# EAGLE design Branly_Pi_v2 (EAGLE 6.5.0)
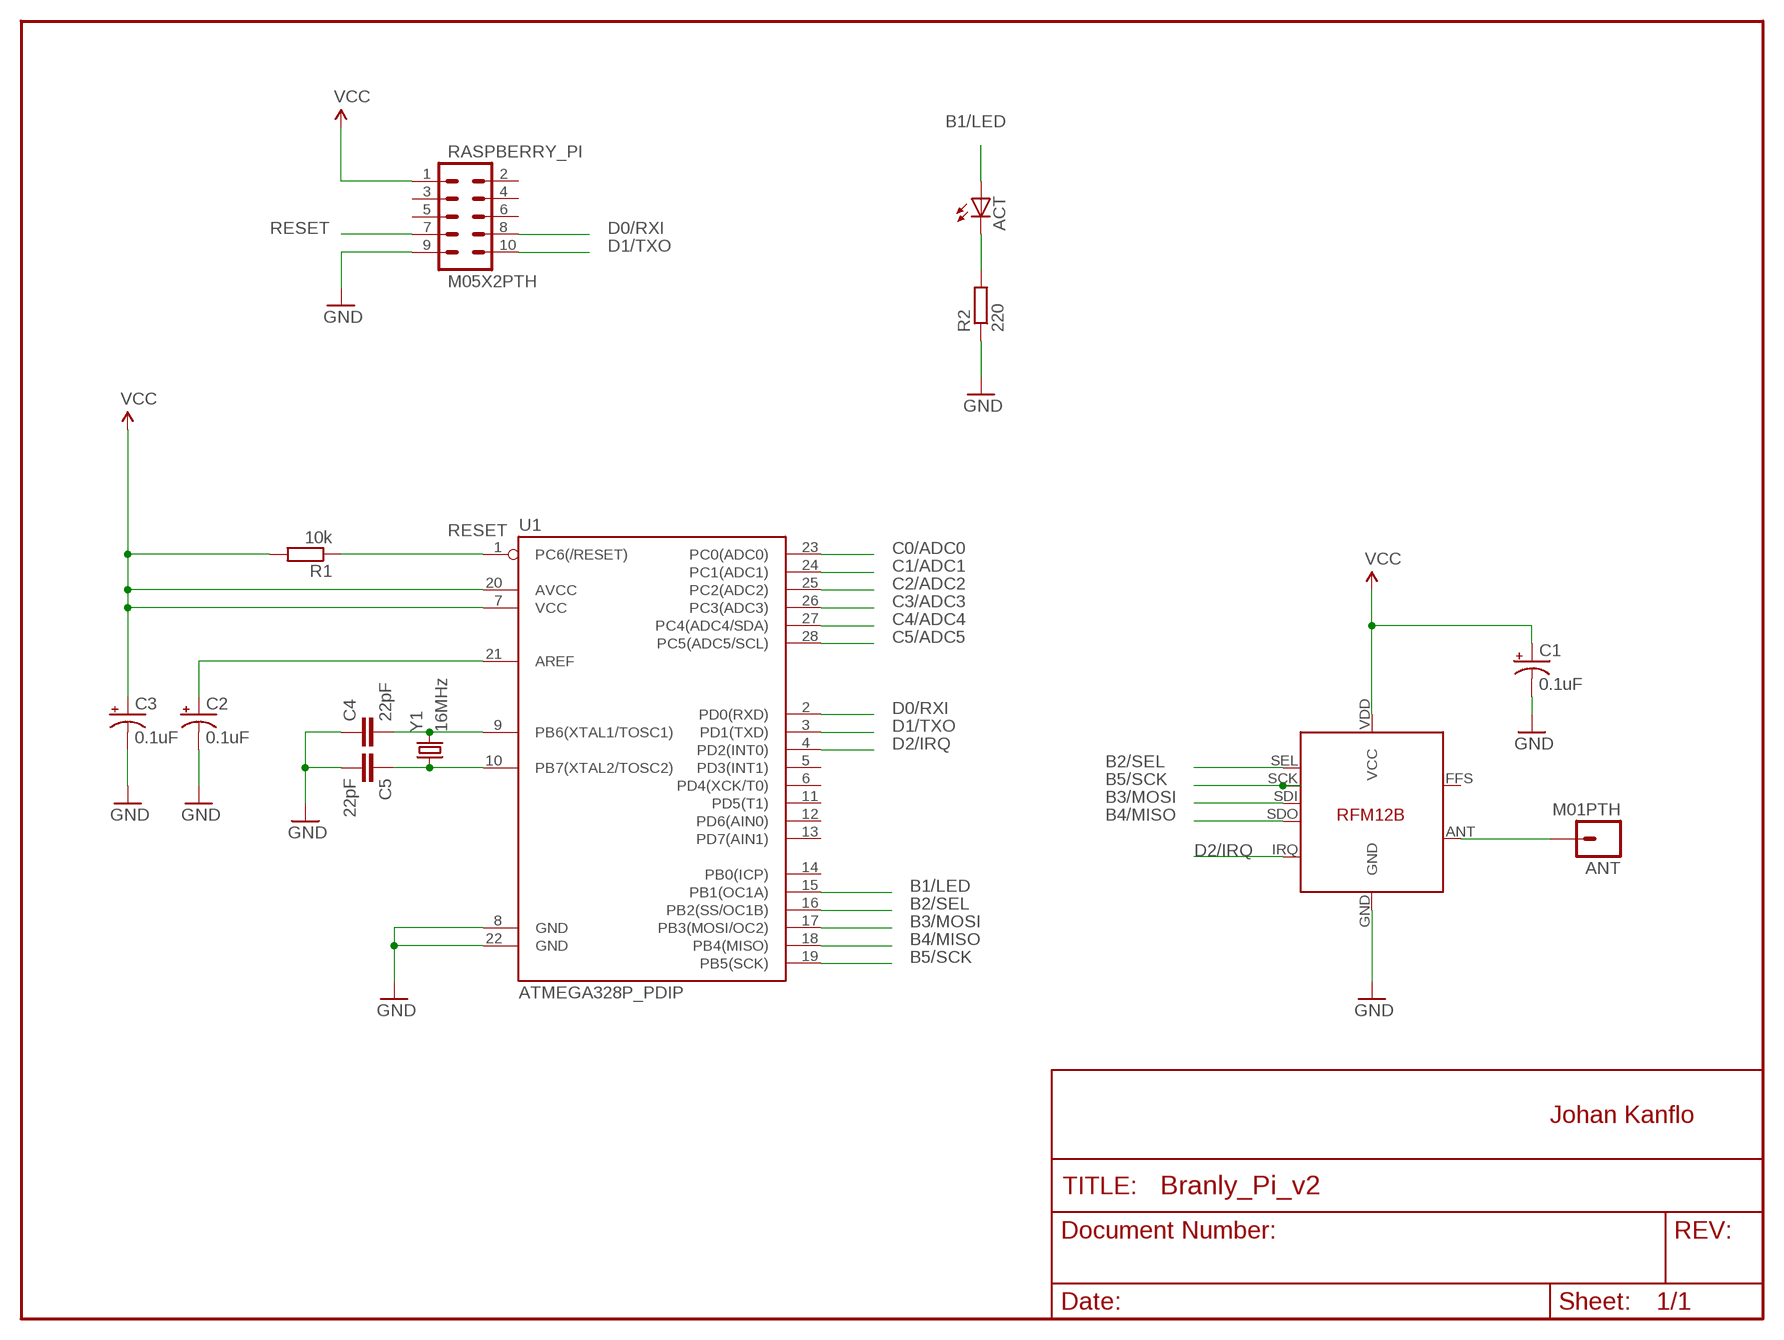
[diagram p0: schematic, sheet 1]

## Parts
ACT  LED5MM  [LED5MM]
ANT  M01PTH  [1X01]
C1  0.1uF  CAP_POLPTH2  [CPOL-RADIAL-10UF-25V]
C2  0.1uF  CAP_POLPTH2  [CPOL-RADIAL-10UF-25V]
C3  0.1uF  CAP_POLPTH2  [CPOL-RADIAL-10UF-25V]
C4  22pF  CAPPTH2  [CAP-PTH-SMALL2]
C5  22pF  CAPPTH2  [CAP-PTH-SMALL2]
R1  10k  R-EU_0207/7  [0207/7]
R2  220  R-EU_0207/7  [0207/7]
RASPBERRY_PI  M05X2PTH  [AVR_ICSP]
U1  ATMEGA328P_PDIP  [DIL28-3]
U2  RFM12B  [RFM12B]
Y1  16MHz  CRYSTALHC49US  [HC49US]

## Nets
ACT: ACT.K(C) R2.2
B1/LED: ACT.A U1.15(PB1(OC1A))
B2/SEL: U1.16(PB2(SS/OC1B)) U2.SEL
B3/MOSI: U1.17(PB3(MOSI/OC2)) U2.SDI
B4/MISO: U1.18(PB4(MISO)) U2.SDO
B5/SCK: U1.19(PB5(SCK)) U2.SCK
C0/ADC0: U1.23(PC0(ADC0))
C1/ADC1: U1.24(PC1(ADC1))
C2/ADC2: U1.25(PC2(ADC2))
C3/ADC3: U1.26(PC3(ADC3))
C4/ADC4: U1.27(PC4(ADC4/SDA))
C5/ADC5: U1.28(PC5(ADC5/SCL))
D0/RXI: RASPBERRY_PI.8 U1.2(PD0(RXD))
D1/TXO: RASPBERRY_PI.10 U1.3(PD1(TXD))
D2/IRQ: U1.4(PD2(INT0)) U2.IRQ
GND: C1.2(-) C2.2(-) C3.2(-) C4.1 C5.2 R2.1 RASPBERRY_PI.9 U1.8(GND) U1.22(GND) U2.GND
N$1: C4.2 U1.9(PB6(XTAL1/TOSC1)) Y1.2
N$2: C2.1(+) U1.21(AREF)
N$5: C5.1 U1.10(PB7(XTAL2/TOSC2)) Y1.1
N$6: ANT.1 U2.ANT
RESET: R1.1 RASPBERRY_PI.7 U1.1(PC6(/RESET))
VCC: C1.1(+) C3.1(+) R1.2 RASPBERRY_PI.1 U1.7(VCC) U1.20(AVCC) U2.VDD(VCC)
Unconnected: RASPBERRY_PI.2 RASPBERRY_PI.3 RASPBERRY_PI.4 RASPBERRY_PI.5 RASPBERRY_PI.6 U1.5(PD3(INT1)) U1.6(PD4(XCK/T0)) U1.11(PD5(T1)) U1.12(PD6(AIN0)) U1.13(PD7(AIN1)) U1.14(PB0(ICP)) U2.FFS

## Notes on the sheet
- Johan Kanflo

## Library data of the parts
ACT = SparkFun-LED:LED: LEDs Standard schematic elements and footprints for 5mm, 3mm, 1206, and 0603 sized LEDs. 5mm - Spark Fun Electronics SKU : COM-00529 (and others)
ANT = SparkFun-Connectors:M01: Header 1 Standard 1-pin 0.1" header. Use with straight break away headers (SKU : PRT-00116), right angle break away headers (PRT-00553), swiss pins (PRT-00743), machine pins (PRT-00117), and female headers (PRT-00115).
C1-C3 = SparkFun-Passives:CAP_POL: Capacitor Polarized These are standard SMD and PTH capacitors. Normally 10uF, 47uF, and 100uF in electrolytic and tantalum varieties. Always verify the external diameter of the through hole cap, it varies with capacity, voltage, and manufacturer. The EIA devices should be standard.
C4 C5 = SparkFun-Capacitors:CAP: Capacitor Standard 0603 ceramic capacitor, and 0.1" leaded capacitor.
R1 R2 = resistor:R-EU_: RESISTOR, European symbol
RASPBERRY_PI = SparkFun-Connectors:M05X2: Header 5x2 Standard 10-pin dual row 0.1" header. Commonly used with AVR-ISP. Use with Spark Fun Electronics SKU: PRT-00778
U1 = SparkFun-DigitalIC:ATMEGA328P_PDIP: uC used in the Arduino 32kb flash, 1k EEPROM, 2k SRAM This is the through-hole version of this chip.
U2 = JeeParts:RFM12B
Y1 = SparkFun-FreqCtrl:CRYSTAL: Various standard crystals. Proven footprints. Spark Fun Electronics SKU : COM-00534

## Board
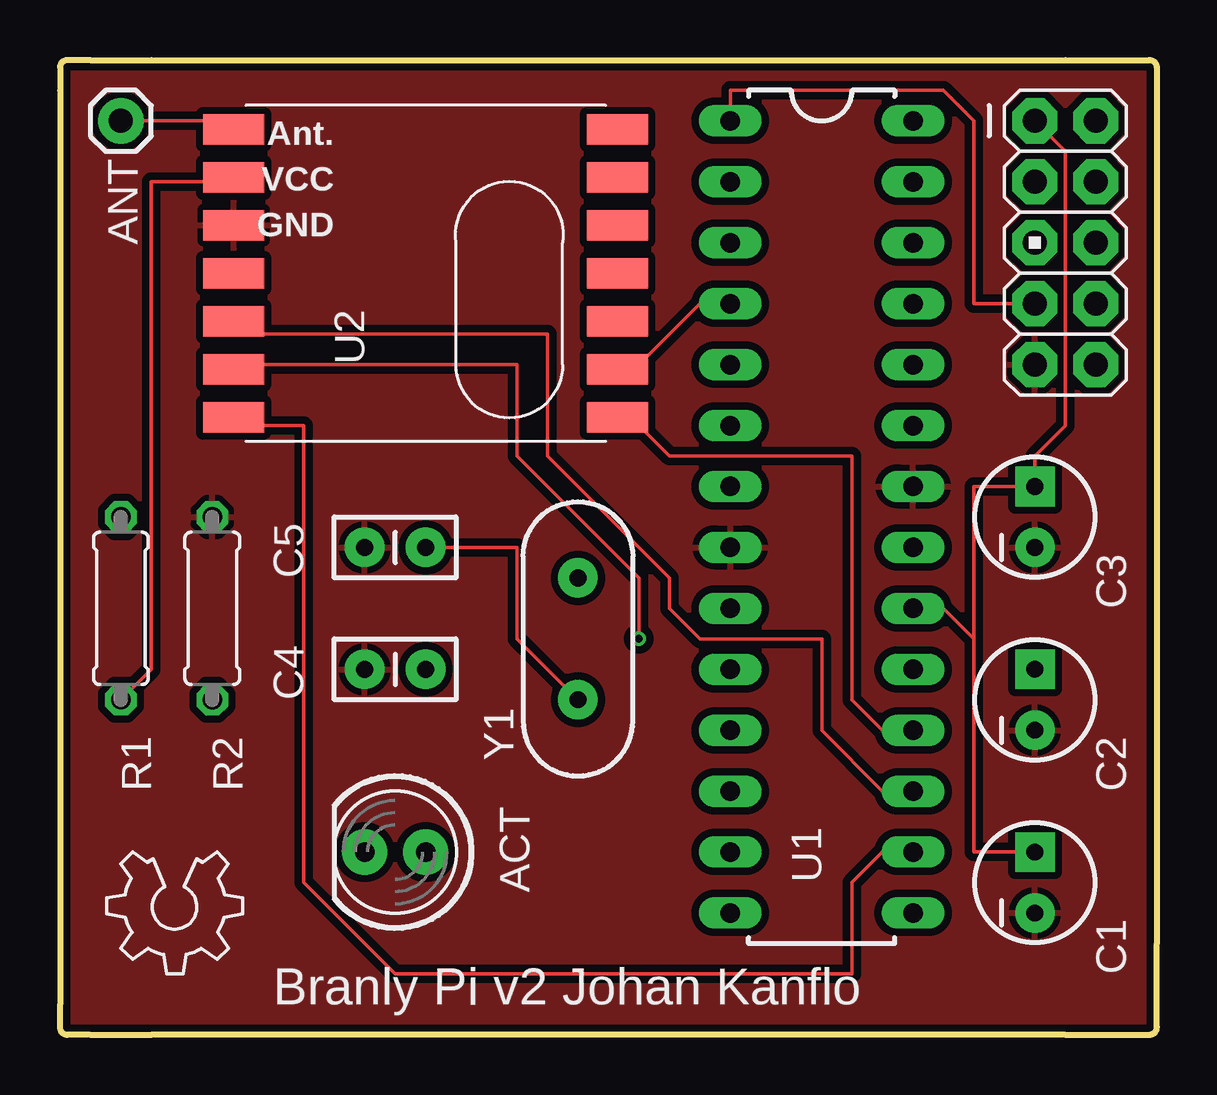
[diagram p1: board, top side]
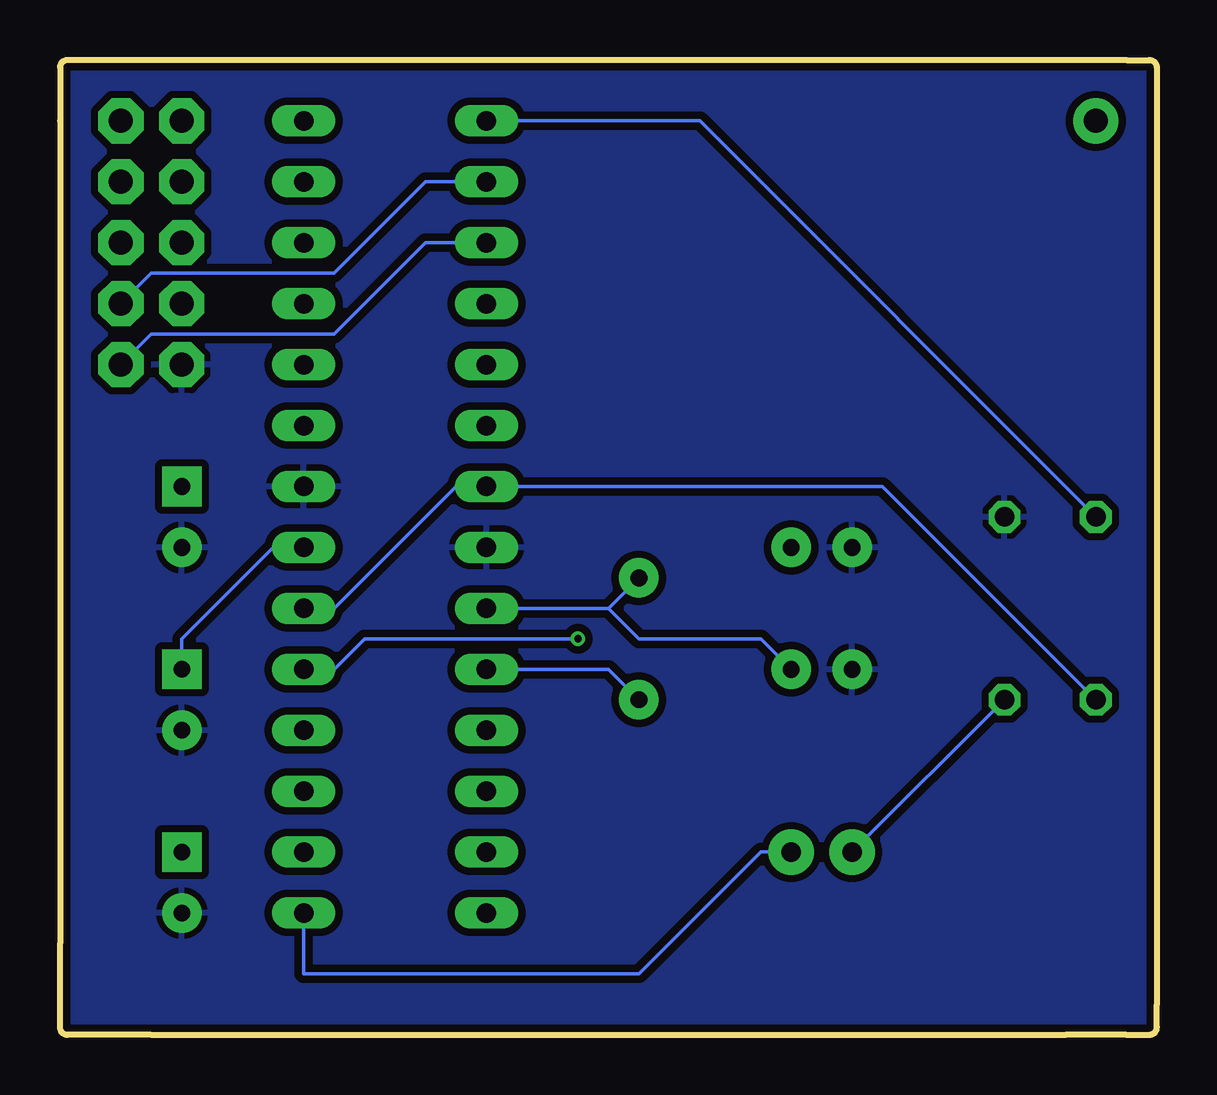
[diagram p2: board, bottom side, seen from below]

Size 45.72 x 40.64 mm. Coordinates in mm from the lower left corner, seen from the top.
Outline: 41.91,0 45.4,0 arc90 45.72,0.32 45.72,3.81 45.72,38.1 45.72,40.32 arc90 45.4,40.64 41.91,40.64 3.81,40.64 1.27,40.64 0.32,40.64 arc90 0,40.32 0,39.37 0,1.27 0,0.32 arc90 0.32,0 1.27,0 3.81,0 41.91,0
Copper layers (1*16): Top 0.035mm / dielectric 1.5mm / Bottom 0.035mm
Design rules "SeeedStudio_2layer_DRU_no_angle_20140221": minimum track width 6mil, minimum drill 12mil, track to track 6mil, track to pad 6mil, pad to pad 6mil, via to via 6mil, smd to smd 0mil, copper to edge 10mil, drill to drill 10mil, minimum pad ring 10mil, minimum via ring 6mil, stop-mask expansion 2mil, vias tented up to drill 100mil, thermal gap 10mil

### Footprints (pad centres in the part's own frame; a part is rotated, then mirrored left to right if it is on the bottom)
LED5MM = drill 0.813 pad 1.88: A -1.27,0; K 1.27,0
1X01 = drill 1 pad 1.88: 1 0,0
CPOL-RADIAL-10UF-25V = drill 0.7 pad 1.651 square: 1 1.27,0 | drill 0.7 pad 1.651: 2 -1.27,0
CAP-PTH-SMALL2 = drill 0.7 pad 1.651: 1 0,0; 2 2.54,0
0207/7 = drill 0.813 octagon: 1 -3.81,0; 2 3.81,0
AVR_ICSP = drill 1 pad 1.88 octagon: 1 -1.27,5.08; 2 1.27,5.08; 3 -1.27,2.54; 4 1.27,2.54; 5 -1.27,0; 6 1.27,0; 7 -1.27,-2.54; 8 1.27,-2.54; 9 -1.27,-5.08; 10 1.27,-5.08
DIL28-3 = drill 0.813 long: 1 -16.51,-3.81; 2 -13.97,-3.81; 3 -11.43,-3.81; 4 -8.89,-3.81; 5 -6.35,-3.81; 6 -3.81,-3.81; 7 -1.27,-3.81; 8 1.27,-3.81; 9 3.81,-3.81; 10 6.35,-3.81; 11 8.89,-3.81; 12 11.43,-3.81; 13 13.97,-3.81; 14 16.51,-3.81; 15 16.51,3.81; 16 13.97,3.81; 17 11.43,3.81; 18 8.89,3.81; 19 6.35,3.81; 20 3.81,3.81; 21 1.27,3.81; 22 -1.27,3.81; 23 -3.81,3.81; 24 -6.35,3.81; 25 -8.89,3.81; 26 -11.43,3.81; 27 -13.97,3.81; 28 -16.51,3.81
RFM12B = smd 2.54 x 1.27: ANT 8,-6; FFS -8,2; GND 8,-2; IRQ -8,4; P$8 -8,0; P$9 -8,-2; P$10 -8,-4; P$12 -8,-6; P$16 8,0; SCK 8,4; SDI 8,2; SDO -8,6; SEL 8,6; VDD 8,-4
HC49US = drill 0.7 pad 1.651: 1 -2.54,0; 2 2.54,0

### Placement (x,y rotation side)
ACT  13.97,7.62 180 top
ANT  2.54,38.1 90 top
C1  40.64,6.35 90 top
C2  40.64,13.97 90 top
C3  40.64,21.59 90 top
C4  12.7,15.24 0 top
C5  15.24,20.32 180 top
R1  2.54,17.78 270 top
R2  6.35,17.78 270 top
RASPBERRY_PI  41.91,33.02 0 top
U1  31.75,21.59 270 top
U2  15.24,31.75 180 top
U$3  [OSHW_6X200_NOTEXT]  7.62,7.62 180 top
Y1  21.59,16.51 90 top

### Tracks (layer width: path | path; a pad name or v marks a point on that pad's centre or on a via)
ACT
  Bottom 0.152: ACT.K R2.2
B1/LED
  Bottom 0.152: U1.15 35.56,2.54 21.59,2.54 16.51,7.62 ACT.A
B2/SEL
  Top 0.152: U1.16 34.29,7.62 33.02,6.35 33.02,2.54 13.97,2.54 10.16,6.35 10.16,25.4 7.62,25.4 U2.SEL
B3/MOSI
  Top 0.152: U1.17 34.29,10.16 31.75,12.7 31.75,16.51 26.67,16.51 25.4,17.78 25.4,19.05 20.32,24.13 20.32,29.21 7.62,29.21 U2.SDI
B4/MISO
  Top 0.152: U1.18 34.29,12.7 33.02,13.97 33.02,24.13 25.4,24.13 24.13,25.4 U2.SDO
B5/SCK  (via drill 0.3)
  Top 0.152: v24.13,16.51 24.13,19.05 19.05,24.13 19.05,27.94 7.62,27.94 U2.SCK
  Bottom 0.152: v24.13,16.51 33.02,16.51 34.29,15.24 U1.19
D0/RXI
  Bottom 0.152: U1.2 30.48,35.56 34.29,31.75 41.91,31.75 RASPBERRY_PI.8
D1/TXO
  Bottom 0.152: U1.3 30.48,33.02 34.29,29.21 41.91,29.21 RASPBERRY_PI.10
D2/IRQ
  Top 0.152: U1.4 26.67,30.48 24.13,27.94 U2.IRQ
GND
  pour Top (isolate 0.305): 0,40.64 45.72,40.64 45.72,0 0,0
  pour Bottom (isolate 0.305): 0,40.64 45.72,40.64 45.72,0 0,0
N$1
  Bottom 0.152: 22.86,17.78 U1.9 | Y1.2 22.86,17.78 | C4.2 16.51,16.51 21.59,16.51 22.86,17.78
N$2
  Bottom 0.152: U1.21 36.83,20.32 40.64,16.51 C2.1
N$5
  Top 0.152: C5.1 19.05,20.32 19.05,16.51 Y1.1
  Bottom 0.152: U1.10 22.86,15.24 Y1.1
N$6
  Top 0.152: ANT.1 6.35,38.1 U2.ANT
RESET
  Top 0.152: RASPBERRY_PI.7 38.1,30.48 38.1,38.1 36.83,39.37 27.94,39.37 U1.1
  Bottom 0.152: R1.1 19.05,38.1 U1.1
VCC
  Top 0.152: R1.2 3.81,15.24 3.81,35.56 6.35,35.56 U2.VDD | C1.1 38.1,7.62 38.1,16.51 | 38.1,16.51 36.83,17.78 U1.20 | 38.1,16.51 38.1,22.86 C3.1 40.64,24.13 41.91,25.4 41.91,36.83 RASPBERRY_PI.1
  Bottom 0.152: U1.20 34.29,17.78 29.21,22.86 U1.7 11.43,22.86 R1.2

### Text on the board
tNames: U2 | C5 | C3 | C4 | R1 | R2 | C2 | U1 | C1 | Branly Pi v2 Johan Kanflo